# Altium project HYDRA_V4_LINK.PrjPcb (part 2 of 2)

## Sheet ETHERNET.SchDoc
size C; SheetNumber: 8; SheetTotal: 10
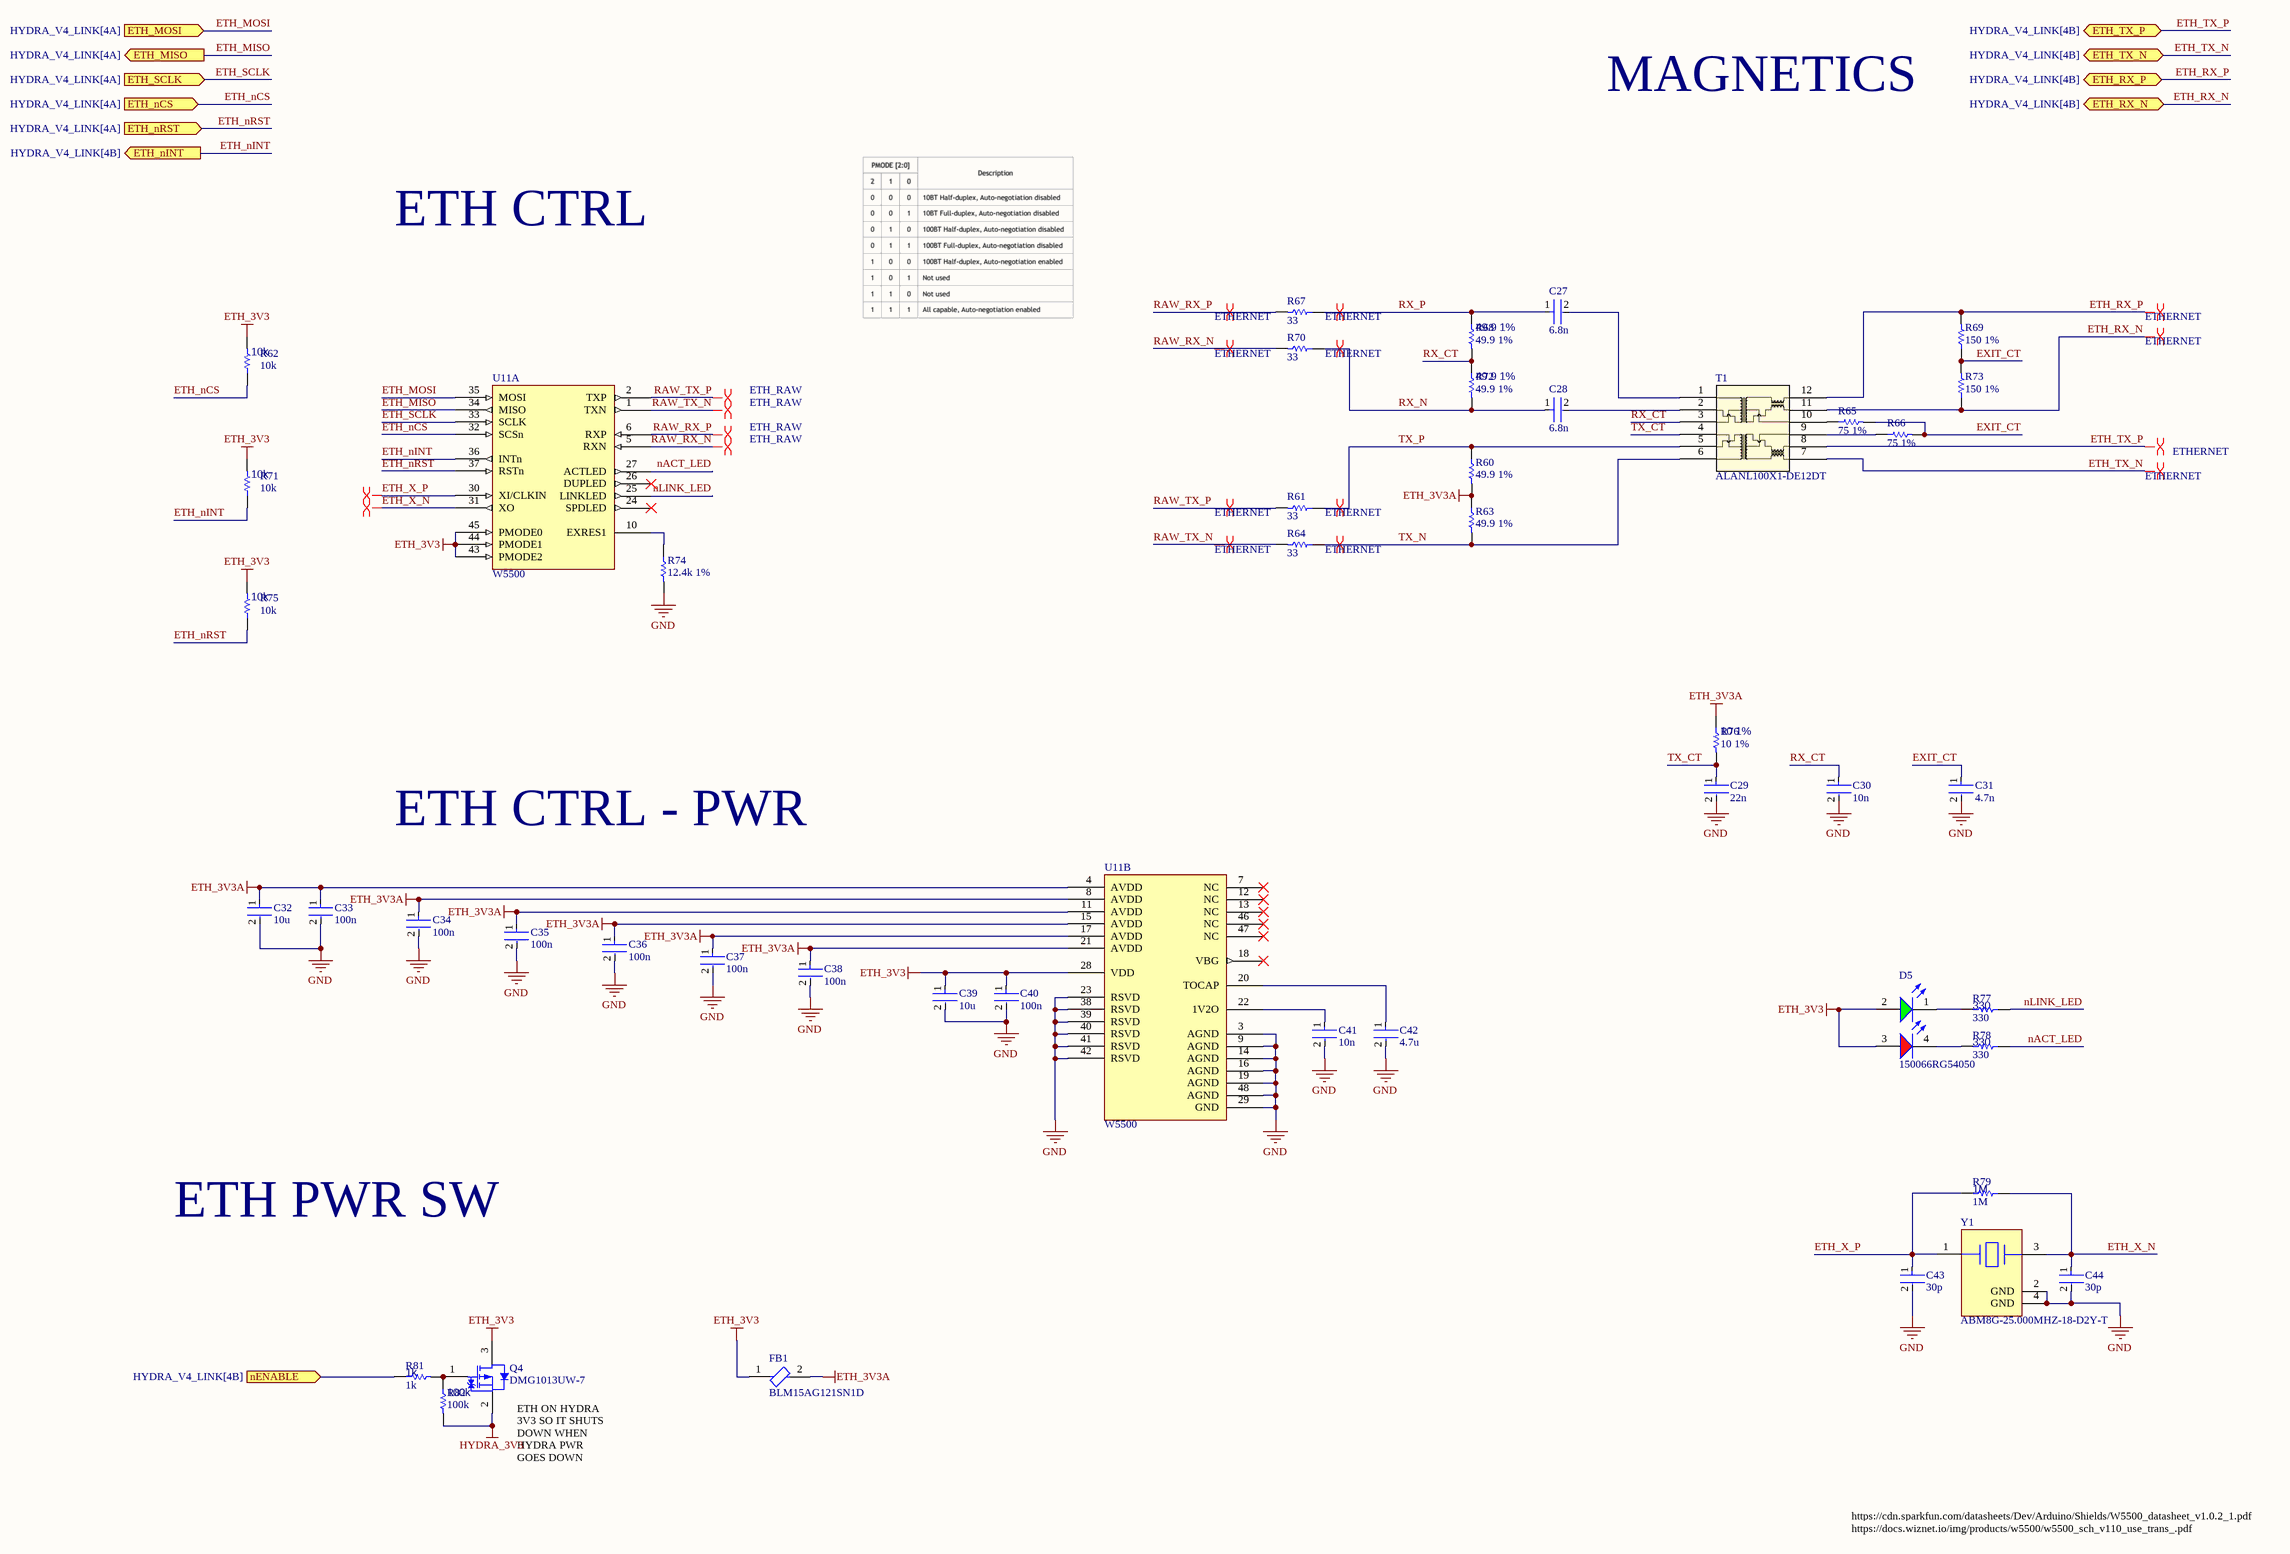
[diagram p6: ETHERNET.SchDoc]

### Parts
C27  6.8n  [FP-0402-L_1_0_0_05-W_0_5-IPC_A]
C28  6.8n  [FP-0402-L_1_0_0_05-W_0_5-IPC_A]
C29  22n  [FP-0402-L_1_0_0_05-W_0_5-IPC_A]
C30  10n  [FP-0402-L_1_0_0_05-W_0_5-IPC_A]
C31  4.7n  [FP-0402-L_1_0_0_05-W_0_5-IPC_A]
C32  10u  [FP-0402-L_1_0_0_05-W_0_5-IPC_A]
C33  100n  [FP-0402-L_1_0_0_05-W_0_5-IPC_A]
C34  100n  [FP-0402-L_1_0_0_05-W_0_5-IPC_A]
C35  100n  [FP-0402-L_1_0_0_05-W_0_5-IPC_A]
C36  100n  [FP-0402-L_1_0_0_05-W_0_5-IPC_A]
C37  100n  [FP-0402-L_1_0_0_05-W_0_5-IPC_A]
C38  100n  [FP-0402-L_1_0_0_05-W_0_5-IPC_A]
C39  10u  [FP-0402-L_1_0_0_05-W_0_5-IPC_A]
C40  100n  [FP-0402-L_1_0_0_05-W_0_5-IPC_A]
C41  10n  [FP-0402-L_1_0_0_05-W_0_5-IPC_A]
C42  4.7u  [FP-0402-L_1_0_0_05-W_0_5-IPC_A]
C43  30p  [FP-0402-L_1_0_0_05-W_0_5-IPC_A]
C44  30p  [FP-0402-L_1_0_0_05-W_0_5-IPC_A]
D5  150066RG54050  [WL-SBCD_0606]
FB1  BLM15AG121SN1D  [FP-BLM15-0_05-MFG]
Q4  DMG1013UW-7  [DIOD-SOT323-3_V]
R60  49.9 1%  [R0603B]
R61  33  [R0603B]
R62  10k  [R0603B]
R63  49.9 1%  [R0603B]
R64  33  [R0603B]
R65  75 1%  [R0603B]
R66  75 1%  [R0603B]
R67  33  [R0603B]
R68  49.9 1%  [R0603B]
R69  150 1%  [R0603B]
R70  33  [R0603B]
R71  10k  [R0603B]
R72  49.9 1%  [R0603B]
R73  150 1%  [R0603B]
R74  12.4k 1%  [R0603B]
R75  10k  [R0603B]
R76  10 1%  [R0603B]
R77  330  [R0603B]
R78  330  [R0603B]
R79  1M  [R0603B]
R81  1k  [R0603B]
R82  100k  [R0603B]
T1  ALANL100X1-DE12DT  [ALANL100X1-DE12DT-Footprint-1]
U11  W5500  [TSQFP50P900X900X160-48N]  (parts A,B of 2)
Y1  ABM8G-25.000MHZ-18-D2Y-T  [FP-ABM8G-MFG]

### Ports
ETH_MISO (out, see HYDRA_V4_LINK[4A]), ETH_MOSI (in, see HYDRA_V4_LINK[4A]), ETH_nCS (in, see HYDRA_V4_LINK[4A]), ETH_nINT (out, see HYDRA_V4_LINK[4B]), ETH_nRST (in, see HYDRA_V4_LINK[4A]), ETH_RX_N (bidir, see HYDRA_V4_LINK[4B]), ETH_RX_P (bidir, see HYDRA_V4_LINK[4B]), ETH_SCLK (in, see HYDRA_V4_LINK[4A]), ETH_TX_N (bidir, see HYDRA_V4_LINK[4B]), ETH_TX_P (bidir, see HYDRA_V4_LINK[4B]), nENABLE (in, see HYDRA_V4_LINK[4B])

### Nets
ETH_3V3: C39.1 C40.1 D5.2(A) D5.3(A) FB1.1 Q4.3(D) R62.2 R71.2 R75.2 U11.28(VDD) U11.43(PMODE2) U11.44(PMODE1) U11.45(PMODE0)
ETH_3V3A: C32.1 C33.1 C34.1 C35.1 C36.1 C37.1 C38.1 FB1.2 R60.2 R63.1 R76.1 U11.4(AVDD) U11.8(AVDD) U11.11(AVDD) U11.15(AVDD) U11.17(AVDD) U11.21(AVDD)
GND: C29.2 C30.2 C31.2 C32.2 C33.2 C34.2 C35.2 C36.2 C37.2 C38.2 C39.2 C40.2 C41.2 C42.2 C43.2 C44.2 R74.2 U11.3(AGND) U11.9(AGND) U11.14(AGND) U11.16(AGND) U11.19(AGND) U11.23(RSVD) U11.29(GND) U11.38(RSVD) U11.39(RSVD) U11.40(RSVD) U11.41(RSVD) U11.42(RSVD) U11.48(AGND) Y1.2(GND) Y1.4(GND)
HYDRA_3V3: Q4.2(S) R82.2  [project net 3V3_OUT]
ETH_MISO: U11.34(MISO) ; port ETH_MISO
ETH_MOSI: U11.35(MOSI) ; port ETH_MOSI
ETH_nCS: R62.1 U11.32(SCSn) ; port ETH_nCS
ETH_nINT: R71.1 U11.36(INTn) ; port ETH_nINT
ETH_nRST: R75.1 U11.37(RSTn) ; port ETH_nRST
ETH_RX_N: R73.1 T1.11(MX1-) ; port ETH_RX_N
ETH_RX_P: R69.2 T1.12(MX1+) ; port ETH_RX_P
ETH_SCLK: U11.33(SCLK) ; port ETH_SCLK
ETH_TX_N: T1.7(MX2-) ; port ETH_TX_N
ETH_TX_P: T1.8(MX2+) ; port ETH_TX_P
ETH_X_N: C44.1 R79.1 U11.31(XO) Y1.3
ETH_X_P: C43.1 R79.2 U11.30(XI/CLKIN) Y1.1
EXIT_CT: C31.1 R65.2 R66.2 R69.1 R73.2
nACT_LED: R78.1 U11.27(ACTLED)
nLINK_LED: R77.1 U11.25(LINKLED)
RAW_RX_N: R70.2 U11.5(RXN)
RAW_RX_P: R67.2 U11.6(RXP)
RAW_TX_N: R64.2 U11.1(TXN)
RAW_TX_P: R61.2 U11.2(TXP)
RX_CT: C30.1 R68.2 R72.1 T1.3(TCT1)
RX_N: C28.1 R70.1 R72.2
RX_P: C27.1 R67.1 R68.1
TX_CT: C29.1 R76.2 T1.4(TCT2)
TX_N: R63.2 R64.1 T1.6(TD2-)
TX_P: R60.1 R61.1 T1.5(TD2+)
NetC27_2: C27.2 T1.1(TD1+)
NetC28_2: C28.2 T1.2(TD1-)
NetC41_1: C41.1 U11.22(1V2O)
NetC42_1: C42.1 U11.20(TOCAP)
NetD5_1: D5.1(K) R77.2
NetD5_4: D5.4(K) R78.2
NetQ4_1: Q4.1(G) R81.2 R82.1
NetR65_1: R65.1 T1.10(MCT1)
NetR66_1: R66.1 T1.9(MCT2)
NetR74_1: R74.1 U11.10(EXRES1)
NetR81_1: R81.1 ; port nENABLE

Not connected (* = marked no-connect by the designer): U11 7(NC)* 12(NC)* 13(NC)* 18(VBG)* 24(SPDLED)* 26(DUPLED)* 46(NC)* 47(NC)*

### Layout directives
differential pair; differential pair class ETH_RAW: RAW_RX_N, RAW_RX_P, RAW_TX_N, RAW_TX_P
differential pair; differential pair class ETHERNET: ETH_RX_N, ETH_RX_P, ETH_TX_N, ETH_TX_P, RAW_RX_N, RAW_RX_P, RAW_TX_N, RAW_TX_P, RX_N, RX_P, TX_N, TX_P
differential pair: ETH_X_N, ETH_X_P

### Notes on the sheet
- MAGNETICS
- ETH CTRL
- ETH CTRL - PWR
- ETH PWR SW
- (near Q4) ETH ON HYDRA 3V3 SO IT SHUTS DOWN WHEN HYDRA PWR GOES DOWN
- https://cdn.sparkfun.com/datasheets/Dev/Arduino/Shields/W5500_datasheet_v1.0.2_1.pdf
- https://docs.wiznet.io/img/products/w5500/w5500_sch_v110_use_trans_.pdf

### Library data of the parts
C27-C44 = CMP-001-00058-1: LARGE PADS, 0402 CAP, CHANGE COMMENT TO MATCH REAL P/N; Capacitor Type: Ceramic; Min Operating Temperature: -55°C; Mounting Technology: Surface Mount; Pins: 2; Case/Package: 0402; RoHS Compliant: Yes; Max Operating Temperature: 85°C
  C27 C28: Value: 6.8n
  C29: Value: 22n
  C30 C41: Value: 10n
  C31: Value: 4.7n
  C32 C39: Value: 10u
  C33-C38 C40: Value: 100n
  C42: Value: 4.7u
  C43 C44: Value: 30p
D5 = CMP-004-00040-2: Led, Red/Grn, 180Mcd/230Mcd, 624Nm/525Nm Rohs Compliant: Yes; Source: rgled.SchLib; Component Type: Standard; Design Item ID: CMP-004-00034-2; Pins: 4
FB1 = CMP-0686-00170-4: Chip Ferrite Bead, 0402, 120Ω @ 100MHz, 0.19Ω, 25%, 550mA; Material: Steel; Max DC Current: 500mA; Shielding: Unshielded; Number of Lines: 1; DC Resistance (DCR): 190mR; Impedance: 120R; Packaging: Tape and Reel; Core Material: Ferrite; Number of Pins: 2; Tolerance: 25%; Case Code (Imperial): 0402; DC Current: 500mA; Termination: SMD/SMT; Height: 0.5mm; REACH SVHC: No SVHC; Max Operating Temperature: 125°C; Case Code (Metric): 1005; Length: 1mm; Test Frequency: 100MHz; Lead Free: Lead Free; Depth: 0.55mm; Max Current Rating: 550mA; Case/Package: 0402; Min Operating Temperature: -55°C; Width: 0.5mm; Military Standard: Not; Frequency: 100MHz; Current Rating: 550mA; Package Quantity: 1; Number of Circuits: 1; Radiation Hardening: No
Q4 = CMP-2000-06170-1: P-Channel Enhancement Mode MOSFET, 310 mW, 20 V, -55 to 150 degC, 3-Pin SOT-323, RoHS, Tape and Reel; Manufacturer: Diodes Inc; Qg Gate Charge: 0.622nC; Drain-Source On Resistance-Max: 750mO; Rated Power Dissipation: 310mW; Drain-to-Source Voltage [Vdss]: 20V; Package Reference: SOT323; Datasheet Version: Rev. 3-2, 09/2013; Package Description: 3-Pin Small Outline Transistor, Body 2 x 1.25 mm, Pitch 0.65 mm; Mounting Technology: SurfaceMount; Manufacturer URL: http://www.diodes.com/; Datasheet URL: http://www.diodes.com/_files/datasheets/ds31861.pdf; Channel Type: P-Channel
R60-R79 R81 R82 = CMP-009-00002-14: Resistor
  R60 R63 R68 R72: Value: 49.9 1%
  R61 R64 R67 R70: Value: 33
  R62 R71 R75: Value: 10k
  R65 R66: Value: 75 1%
  R69 R73: Value: 150 1%
  R74: Value: 12.4k 1%
  R76: Value: 10 1%
  R77 R78: Value: 330
  R79: Value: 1M
  R81: Value: 1k
  R82: Value: 100k
T1 = CMP-012-00013-1: Datacom Transformer, LAN; 10/100 BASE-TX; ETHERNET Application(s), 1CT:1CT
U11 = CMP-015-0000-2: Ethernet CTLR Single Chip 10Mbps/100Mbps 3.3V 48-Pin LQFP Reel; Max Supply Current: 132mA; Number of Transceivers: 1; Max Supply Voltage: 3.63V; Interface: SPI; Min Supply Voltage: 2.97V; Min Operating Temperature: -40°C; Operating Supply Current: 132mA; Number of Pins: 48; Lead Free: Lead Free; Packaging: Tray; Package Quantity: 250; Case/Package: LQFP; Max Operating Temperature: 85°C
Y1 = CMP-2000-05733-3: Crystal 25MHz ±20ppm (Tol) ±30ppm (Stability) 18pF FUND 60Ω 4-Pin SMD T/R; Series Resistance: 60R; Length: 3.2mm; Depth: 2.5mm; Packaging: Tape and Reel; Min Operating Temperature: -40°C; Operating Frequency: 25 MHz; Lead Free: Lead Free; Number of Pins: 4; Frequency Tolerance: 20ppm; Radiation Hardening: No; Max Operating Temperature: 85°C; Termination: SMD/SMT; Frequency Stability: 30ppm; Frequency: 25MHz; Series: ABM8G; Mount: Surface Mount; Package Quantity: 1000; Height: 0.039inch; Width: 0.098inch; Case/Package: CSMD; ESR (Equivalent Series Resistance): 60R; Load Capacitance: 18pF; Tolerance: 20ppm

## Sheet RADIO.SchDoc
size A; SheetNumber: 4; SheetTotal: 10
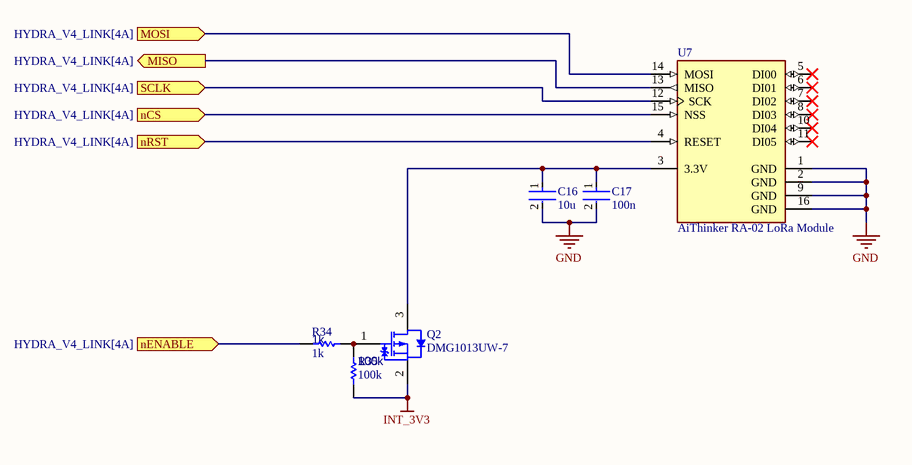
[diagram p7: RADIO.SchDoc]

### Parts
C16  10u  [FP-0402-L_1_0_0_05-W_0_5-IPC_A]
C17  100n  [FP-0402-L_1_0_0_05-W_0_5-IPC_A]
Q2  DMG1013UW-7  [DIOD-SOT323-3_V]
R34  1k  [R0603B]
R35  100k  [R0603B]
U7  AiThinker RA-02 LoRa Module  [AiThinker RA-02 LoRa Module-Footprint-1]

### Ports
MISO (out, see HYDRA_V4_LINK[4A]), MOSI (in, see HYDRA_V4_LINK[4A]), nCS (in, see HYDRA_V4_LINK[4A]), nENABLE (in, see HYDRA_V4_LINK[4A]), nRST (in, see HYDRA_V4_LINK[4A]), SCLK (in, see HYDRA_V4_LINK[4A])

### Nets
GND: C16.2 C17.2 U7.1(GND) U7.2(GND) U7.9(GND) U7.16(GND)
INT_3V3: Q2.2(S) R35.2
ETH_MISO: U7.13(MISO) ; port MISO
ETH_MOSI: U7.14(MOSI) ; port MOSI
ETH_SCLK: U7.12(SCK) ; port SCLK
NetC16_1: C16.1 C17.1 Q2.3(D) U7.3(3.3V)
NetQ2_1: Q2.1(G) R34.2 R35.1
NetR34_1: R34.1 ; port nENABLE
NetU7_4: U7.4(RESET) ; port nRST
NetU7_15: U7.15(NSS) ; port nCS

Not connected (* = marked no-connect by the designer): U7 5(DI00)* 6(DI01)* 7(DI02)* 8(DI03)* 10(DI04)* 11(DI05)*

### Library data of the parts
C16 C17 = CMP-001-00058-1: as C27 on sheet ETHERNET; Min Operating Temperature: -55°C; Mounting Technology: Surface Mount; Pins: 2; Case/Package: 0402; RoHS Compliant: Yes; Max Operating Temperature: 85°C
  C16: Value: 10u
  C17: Value: 100n
Q2 = CMP-2000-06170-1: as Q4 on sheet ETHERNET; Package Reference: SOT323; Datasheet Version: Rev. 3-2, 09/2013; Package Description: 3-Pin Small Outline Transistor, Body 2 x 1.25 mm, Pitch 0.65 mm; Mounting Technology: SurfaceMount; Manufacturer URL: http://www.diodes.com/; Datasheet URL: http://www.diodes.com/_files/datasheets/ds31861.pdf; Channel Type: P-Channel
R34 R35 = CMP-009-00002-14: Resistor
  R34: Value: 1k
  R35: Value: 100k
U7 = CMP-021-00000-1

## Sheet TCAN330_PINOUT.SchDoc
size A4; SheetNumber: 10; SheetTotal: 10
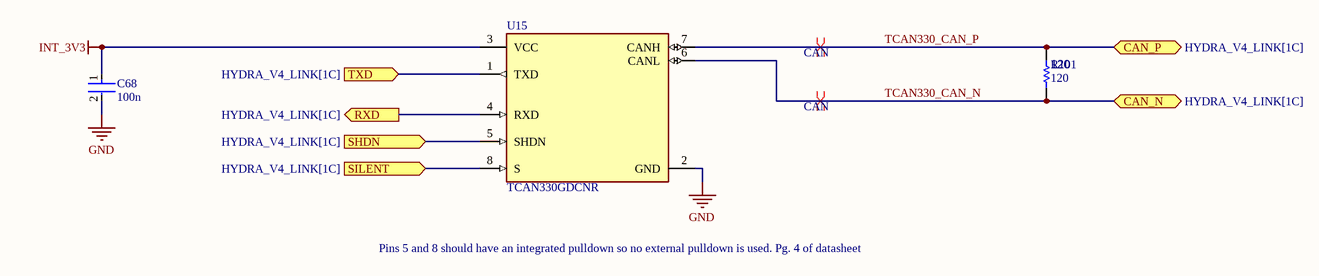
[diagram p8: TCAN330_PINOUT.SchDoc]

### Parts
C68  100n  [FP-0402-L_1_0_0_05-W_0_5-IPC_A]
R101  120  [R0603B]
U15  TCAN330GDCNR  [FP-DCN0008A-MFG]

### Ports
CAN_N (bidir, see HYDRA_V4_LINK[1C]), CAN_P (bidir, see HYDRA_V4_LINK[1C]), RXD (out, see HYDRA_V4_LINK[1C]), SHDN (in, see HYDRA_V4_LINK[1C]), SILENT (in, see HYDRA_V4_LINK[1C]), TXD (in, see HYDRA_V4_LINK[1C])

### Nets
GND: C68.2 U15.2(GND)
INT_3V3: C68.1 U15.3(VCC)
TCAN330_CAN_N: R101.1 U15.6(CANL) ; port CAN_N  [project net CAN1_N]
TCAN330_CAN_P: R101.2 U15.7(CANH) ; port CAN_P  [project net CAN1_P]
NetU12_61: U15.4(RXD) ; port RXD
NetU12_62: U15.1(TXD) ; port TXD
NetU15_5: U15.5(SHDN) ; port SHDN
NetU15_8: U15.8(S) ; port SILENT

### Layout directives
differential pair; net class CAN: CAN1_N, CAN1_P

### Notes on the sheet
- Pins 5 and 8 should have an integrated pulldown so no external pulldown is used. Pg. 4 of datasheet

### Library data of the parts
C68 = CMP-001-00058-1: as C27 on sheet ETHERNET; Value: 100n; Min Operating Temperature: -55°C; Mounting Technology: Surface Mount; Pins: 2; Case/Package: 0402; RoHS Compliant: Yes; Max Operating Temperature: 85°C
R101 = CMP-009-00002-14: Resistor; Value: 120
U15 = CMP-04872-000178-1: IC TRANSCEIVER 1/1 SOT23-8; Data Rate: 1Mbps; Packaging: Tape and Reel; Min Operating Temperature: -40°C; Max Operating Temperature: 125°C; RoHS Compliant: Yes; Lead Free: Lead Free; Case/Package: SOT-23-8; Mount: Surface Mount

## Sheet TCAN1146_PINOUT.SchDoc
size A4; SheetNumber: 9; SheetTotal: 10
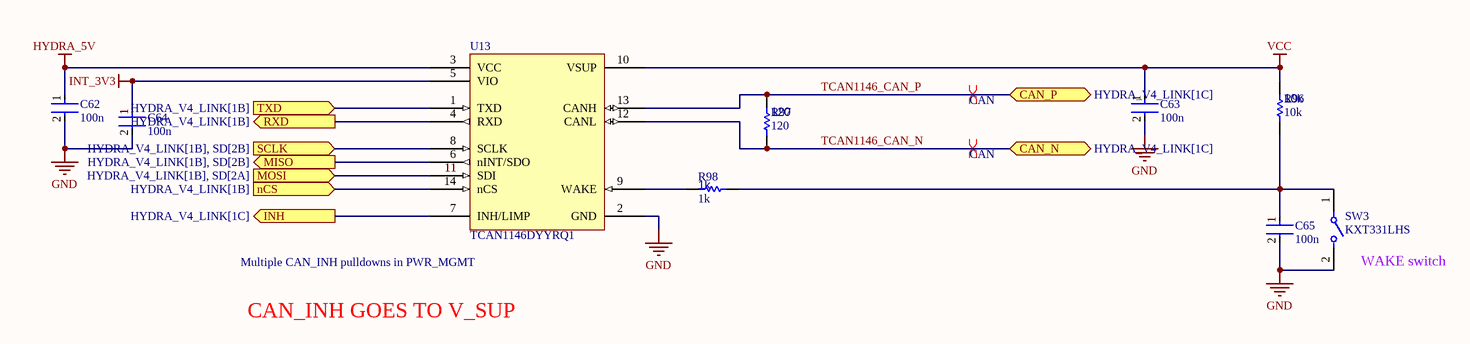
[diagram p9: TCAN1146_PINOUT.SchDoc]

### Parts
C62  100n  [FP-0402-L_1_0_0_05-W_0_5-IPC_A]
C63  100n  [FP-0402-L_1_0_0_05-W_0_5-IPC_A]
C64  100n  [FP-0402-L_1_0_0_05-W_0_5-IPC_A]
C65  100n  [FP-0402-L_1_0_0_05-W_0_5-IPC_A]
R96  10k  [R0603B]
R97  120  [R0603B]
R98  1k  [R0603B]
SW3  KXT331LHS  [FP-KXT331LHS-MFG]
U13  TCAN1146DYYRQ1  [TCAN1146DYYRQ1-Footprint-1]

### Ports
CAN_N (bidir, see HYDRA_V4_LINK[1C]), CAN_P (bidir, see HYDRA_V4_LINK[1C]), INH (out, see HYDRA_V4_LINK[1C]), MISO (out, see HYDRA_V4_LINK[1B], SD[2B]), MOSI (in, see HYDRA_V4_LINK[1B], SD[2A]), nCS (in, see HYDRA_V4_LINK[1B]), RXD (out, see HYDRA_V4_LINK[1B]), SCLK (in, see HYDRA_V4_LINK[1B], SD[2B]), TXD (in, see HYDRA_V4_LINK[1B])

### Nets
GND: C62.2 C63.2 C64.2 C65.2 SW3.2 U13.2(GND)
HYDRA_5V: C62.1 U13.3(VCC)  [project net 5V]
INT_3V3: C64.1 U13.5(VIO)
VCC: C63.1 R96.2 U13.10(VSUP)
CAN_INH: U13.7(INH/LIMP) ; port INH
SD_CLK: U13.8(SCLK) ; port SCLK
SD_CMD: U13.11(SDI) ; port MOSI
SD_DAT0: U13.6(nINT/SDO) ; port MISO
TCAN1146_CAN_N: R97.1 U13.12(CANL) ; port CAN_N  [project net CAN0_N]
TCAN1146_CAN_P: R97.2 U13.13(CANH) ; port CAN_P  [project net CAN0_P]
NetC65_1: C65.1 R96.1 R98.1 SW3.1
NetR98_2: R98.2 U13.9(WAKE)
NetU12_57: U13.14(nCS) ; port nCS
NetU12_58: U13.4(RXD) ; port RXD
NetU12_59: U13.1(TXD) ; port TXD

### Layout directives
differential pair; net class CAN: CAN0_N, CAN0_P

### Notes on the sheet
- (near U13) Multiple CAN_INH pulldowns in PWR_MGMT
- (near SW3) WAKE switch
- CAN_INH GOES TO V_SUP

### Library data of the parts
C62-C65 = CMP-001-00058-1: as C27 on sheet ETHERNET; Value: 100n; Min Operating Temperature: -55°C; Mounting Technology: Surface Mount; Pins: 2; Case/Package: 0402; RoHS Compliant: Yes; Max Operating Temperature: 85°C
R96-R98 = CMP-009-00002-14: Resistor
  R96: Value: 10k
  R97: Value: 120
  R98: Value: 1k
SW3 = CMP-10040-000029-1: SWITCH TACTILE SPST-NO 0.02A 15V; Operating Force: 240gf; Switch Travel: 0.13mm; Illumination Type: Non-Illuminated; Throw Configuration: SPST; Number of Ports: 1; Current Rating: 5A; Mechanical Life: 500000Cycles; Switch Function: Off-Mom; Connector Type: USB; Actuator Type: Standard; Gender: Receptacle; Number of Contacts: 24; Contact Plating: Gold; Insulation Color: Black; Min Operating Temperature: -40°C; Packaging: Tape and Reel; Flammability Rating: UL94 V-0; Max Operating Temperature: 85°C; Termination: Solder; Mount: Surface Mount
U13 = CMP-318-000000-2: Automotive CAN FD transceiver with watchdog, bus diagnostics and partial networking via sele 14-SOT-23-THIN -40 to 150; Component Type: Standard; Design Item ID: CMP-015-00012-2; Pin Count: 14; Source: TCAN1146DYYRQ1.SchLib

## Nets that join several sheets
3V3_OUT: OC_PROT (R11.2 R15.1 U2.10), BATT_MGMT (R27.1 U6.3), ETHERNET (Q4.2 R82.2)
5V: OC_PROT (R3.2 U1.10), BATT_MGMT (C7.1 R21.1 R22.2 U3.1), RFD_PWR_MGMT (R54.1 R58.1 U10.3), TCAN1146_PINOUT (C62.1 U13.3)
AUX_RADIO_PWR: HYDRA_V4_LINK (J6.8), RFD_PWR_MGMT (F3.2)
GND: HYDRA_V4_LINK (41 pins), OC_PROT (22 pins), BATT_MGMT (27 pins), STM32G473CET6_PINOUT (26 pins), SD (7 pins), RFD_PWR_MGMT (27 pins), ETHERNET (32 pins), RADIO (6 pins), TCAN330_PINOUT (C68.2 U15.2), TCAN1146_PINOUT (6 pins)
INT_3V3: HYDRA_V4_LINK (R90.2 R91.2), BATT_MGMT (9 pins), STM32G473CET6_PINOUT (16 pins), SD (9 pins), RFD_PWR_MGMT (C20.1 R46.2 R47.2 U8.12), RADIO (Q2.2 R35.2), TCAN330_PINOUT (C68.1 U15.3), TCAN1146_PINOUT (C64.1 U13.5)
VCC: HYDRA_V4_LINK (J1.01 J1.02 J3.01 J3.02), OC_PROT (R16.1 R26.1 R83.2), TCAN1146_PINOUT (C63.1 R96.2 U13.10)
BATT_TS: BATT_MGMT (R21.2 U3.9), STM32G473CET6_PINOUT (U12.38)
BST_nFLT: BATT_MGMT (D3.4 U4.6 U5.14), STM32G473CET6_PINOUT (U12.44)
CAN0_N: HYDRA_V4_LINK (J1.16 J3.16), TCAN1146_PINOUT (R97.1 U13.12)
CAN0_P: HYDRA_V4_LINK (J1.15 J3.15), TCAN1146_PINOUT (R97.2 U13.13)
CAN1_N: HYDRA_V4_LINK (J1.20 J3.20), TCAN330_PINOUT (R101.1 U15.6)
CAN1_P: HYDRA_V4_LINK (J1.19 J3.19), TCAN330_PINOUT (R101.2 U15.7)
CAN_INH: OC_PROT (Q5.2 R7.2), BATT_MGMT (R31.1), TCAN1146_PINOUT (U13.7)
CHG_N: BATT_MGMT (R19.2 U3.8), STM32G473CET6_PINOUT (U12.39)
ETH_MISO: STM32G473CET6_PINOUT (U12.20), ETHERNET (U11.34), RADIO (U7.13)
ETH_MOSI: STM32G473CET6_PINOUT (U12.21), ETHERNET (U11.35), RADIO (U7.14)
ETH_nCS: STM32G473CET6_PINOUT (U12.18), ETHERNET (R62.1 U11.32)
ETH_nINT: STM32G473CET6_PINOUT (U12.23), ETHERNET (R71.1 U11.36)
ETH_nRST: STM32G473CET6_PINOUT (U12.22), ETHERNET (R75.1 U11.37)
ETH_RX_N: HYDRA_V4_LINK (J6.3), ETHERNET (R73.1 T1.11)
ETH_RX_P: HYDRA_V4_LINK (J6.4), ETHERNET (R69.2 T1.12)
ETH_SCLK: STM32G473CET6_PINOUT (U12.19), ETHERNET (U11.33), RADIO (U7.12)
ETH_TX_N: HYDRA_V4_LINK (J6.1), ETHERNET (T1.7)
ETH_TX_P: HYDRA_V4_LINK (J6.2), ETHERNET (T1.8)
ISET2: BATT_MGMT (R18.2 U3.7), STM32G473CET6_PINOUT (U12.40)
MCU_G_LED: HYDRA_V4_LINK (D7.1), STM32G473CET6_PINOUT (U12.41)
MCU_R_LED: HYDRA_V4_LINK (D7.4), STM32G473CET6_PINOUT (U12.45)
NetD4_1: HYDRA_V4_LINK (D4.1 R33.2), STM32G473CET6_PINOUT (U12.54)
NetD6_1: HYDRA_V4_LINK (D6.1 R44.2), STM32G473CET6_PINOUT (U12.55)
NetQ3_2: STM32G473CET6_PINOUT (U12.52), RFD_PWR_MGMT (Q3.2 R50.1)
NetQ3_5: STM32G473CET6_PINOUT (U12.51), RFD_PWR_MGMT (Q3.5 R59.1)
NetR3_1: OC_PROT (R3.1 R6.2), STM32G473CET6_PINOUT (U12.9)
NetR5_1: OC_PROT (R5.1 U1.9), STM32G473CET6_PINOUT (U12.8)
NetR11_1: OC_PROT (R11.1 R14.2), STM32G473CET6_PINOUT (U12.11)
NetR13_1: OC_PROT (R13.1 U2.9), STM32G473CET6_PINOUT (U12.10)
NetR24_2: BATT_MGMT (R24.2 R25.1), STM32G473CET6_PINOUT (U12.12)
NetR27_2: BATT_MGMT (R27.2 U6.8), STM32G473CET6_PINOUT (U12.46)
NetR28_2: BATT_MGMT (R28.2 R29.1), STM32G473CET6_PINOUT (U12.43)
NetR34_1: STM32G473CET6_PINOUT (U12.60), RADIO (R34.1)
NetR42_1: STM32G473CET6_PINOUT (U12.17), RFD_PWR_MGMT (R42.1 R43.2)
NetR56_1: STM32G473CET6_PINOUT (U12.25), RFD_PWR_MGMT (R56.1 R57.2)
NetR58_2: STM32G473CET6_PINOUT (U12.42), RFD_PWR_MGMT (R58.2 U10.8)
NetR81_1: STM32G473CET6_PINOUT (U12.24), ETHERNET (R81.1)
NetR83_1: OC_PROT (R83.1 R84.2), STM32G473CET6_PINOUT (U12.26)
NetU4_11: BATT_MGMT (U4.11), STM32G473CET6_PINOUT (U12.13)
NetU7_4: STM32G473CET6_PINOUT (U12.53), RADIO (U7.4)
NetU7_15: STM32G473CET6_PINOUT (U12.2), RADIO (U7.15)
NetU8_11: STM32G473CET6_PINOUT (U12.14), RFD_PWR_MGMT (U8.11)
NetU12_57: STM32G473CET6_PINOUT (U12.57), TCAN1146_PINOUT (U13.14)
NetU12_58: STM32G473CET6_PINOUT (U12.58), TCAN1146_PINOUT (U13.4)
NetU12_59: STM32G473CET6_PINOUT (U12.59), TCAN1146_PINOUT (U13.1)
NetU12_61: STM32G473CET6_PINOUT (U12.61), TCAN330_PINOUT (U15.4)
NetU12_62: STM32G473CET6_PINOUT (U12.62), TCAN330_PINOUT (U15.1)
nREG_FLT: STM32G473CET6_PINOUT (U12.30), RFD_PWR_MGMT (R47.1 U8.6 U9.4)
PRE_3V3: HYDRA_V4_LINK (8 pins), OC_PROT (C4.1 R9.1 U2.1 U2.2)
PRE_5V: HYDRA_V4_LINK (8 pins), OC_PROT (C1.1 R1.1 U1.1 U1.2)
PYRO_PWR: HYDRA_V4_LINK (16 pins), RFD_PWR_MGMT (F2.1)
SD_CD: STM32G473CET6_PINOUT (U12.33), SD (R41.2 SD1.9)
SD_CLK: STM32G473CET6_PINOUT (U12.35), SD (R39.2 SD1.5), TCAN1146_PINOUT (U13.8)
SD_CMD: STM32G473CET6_PINOUT (U12.37), SD (R36.2 SD1.3), TCAN1146_PINOUT (U13.11)
SD_CS: STM32G473CET6_PINOUT (U12.34), SD (R40.2 SD1.2)
SD_DAT0: STM32G473CET6_PINOUT (U12.36), SD (R37.2 SD1.7), TCAN1146_PINOUT (U13.6)